# Altium schematic sheet FPGA_BANK.SchDoc
size 420 x 297 mm; SheetNumber: 29; SheetTotal: 34
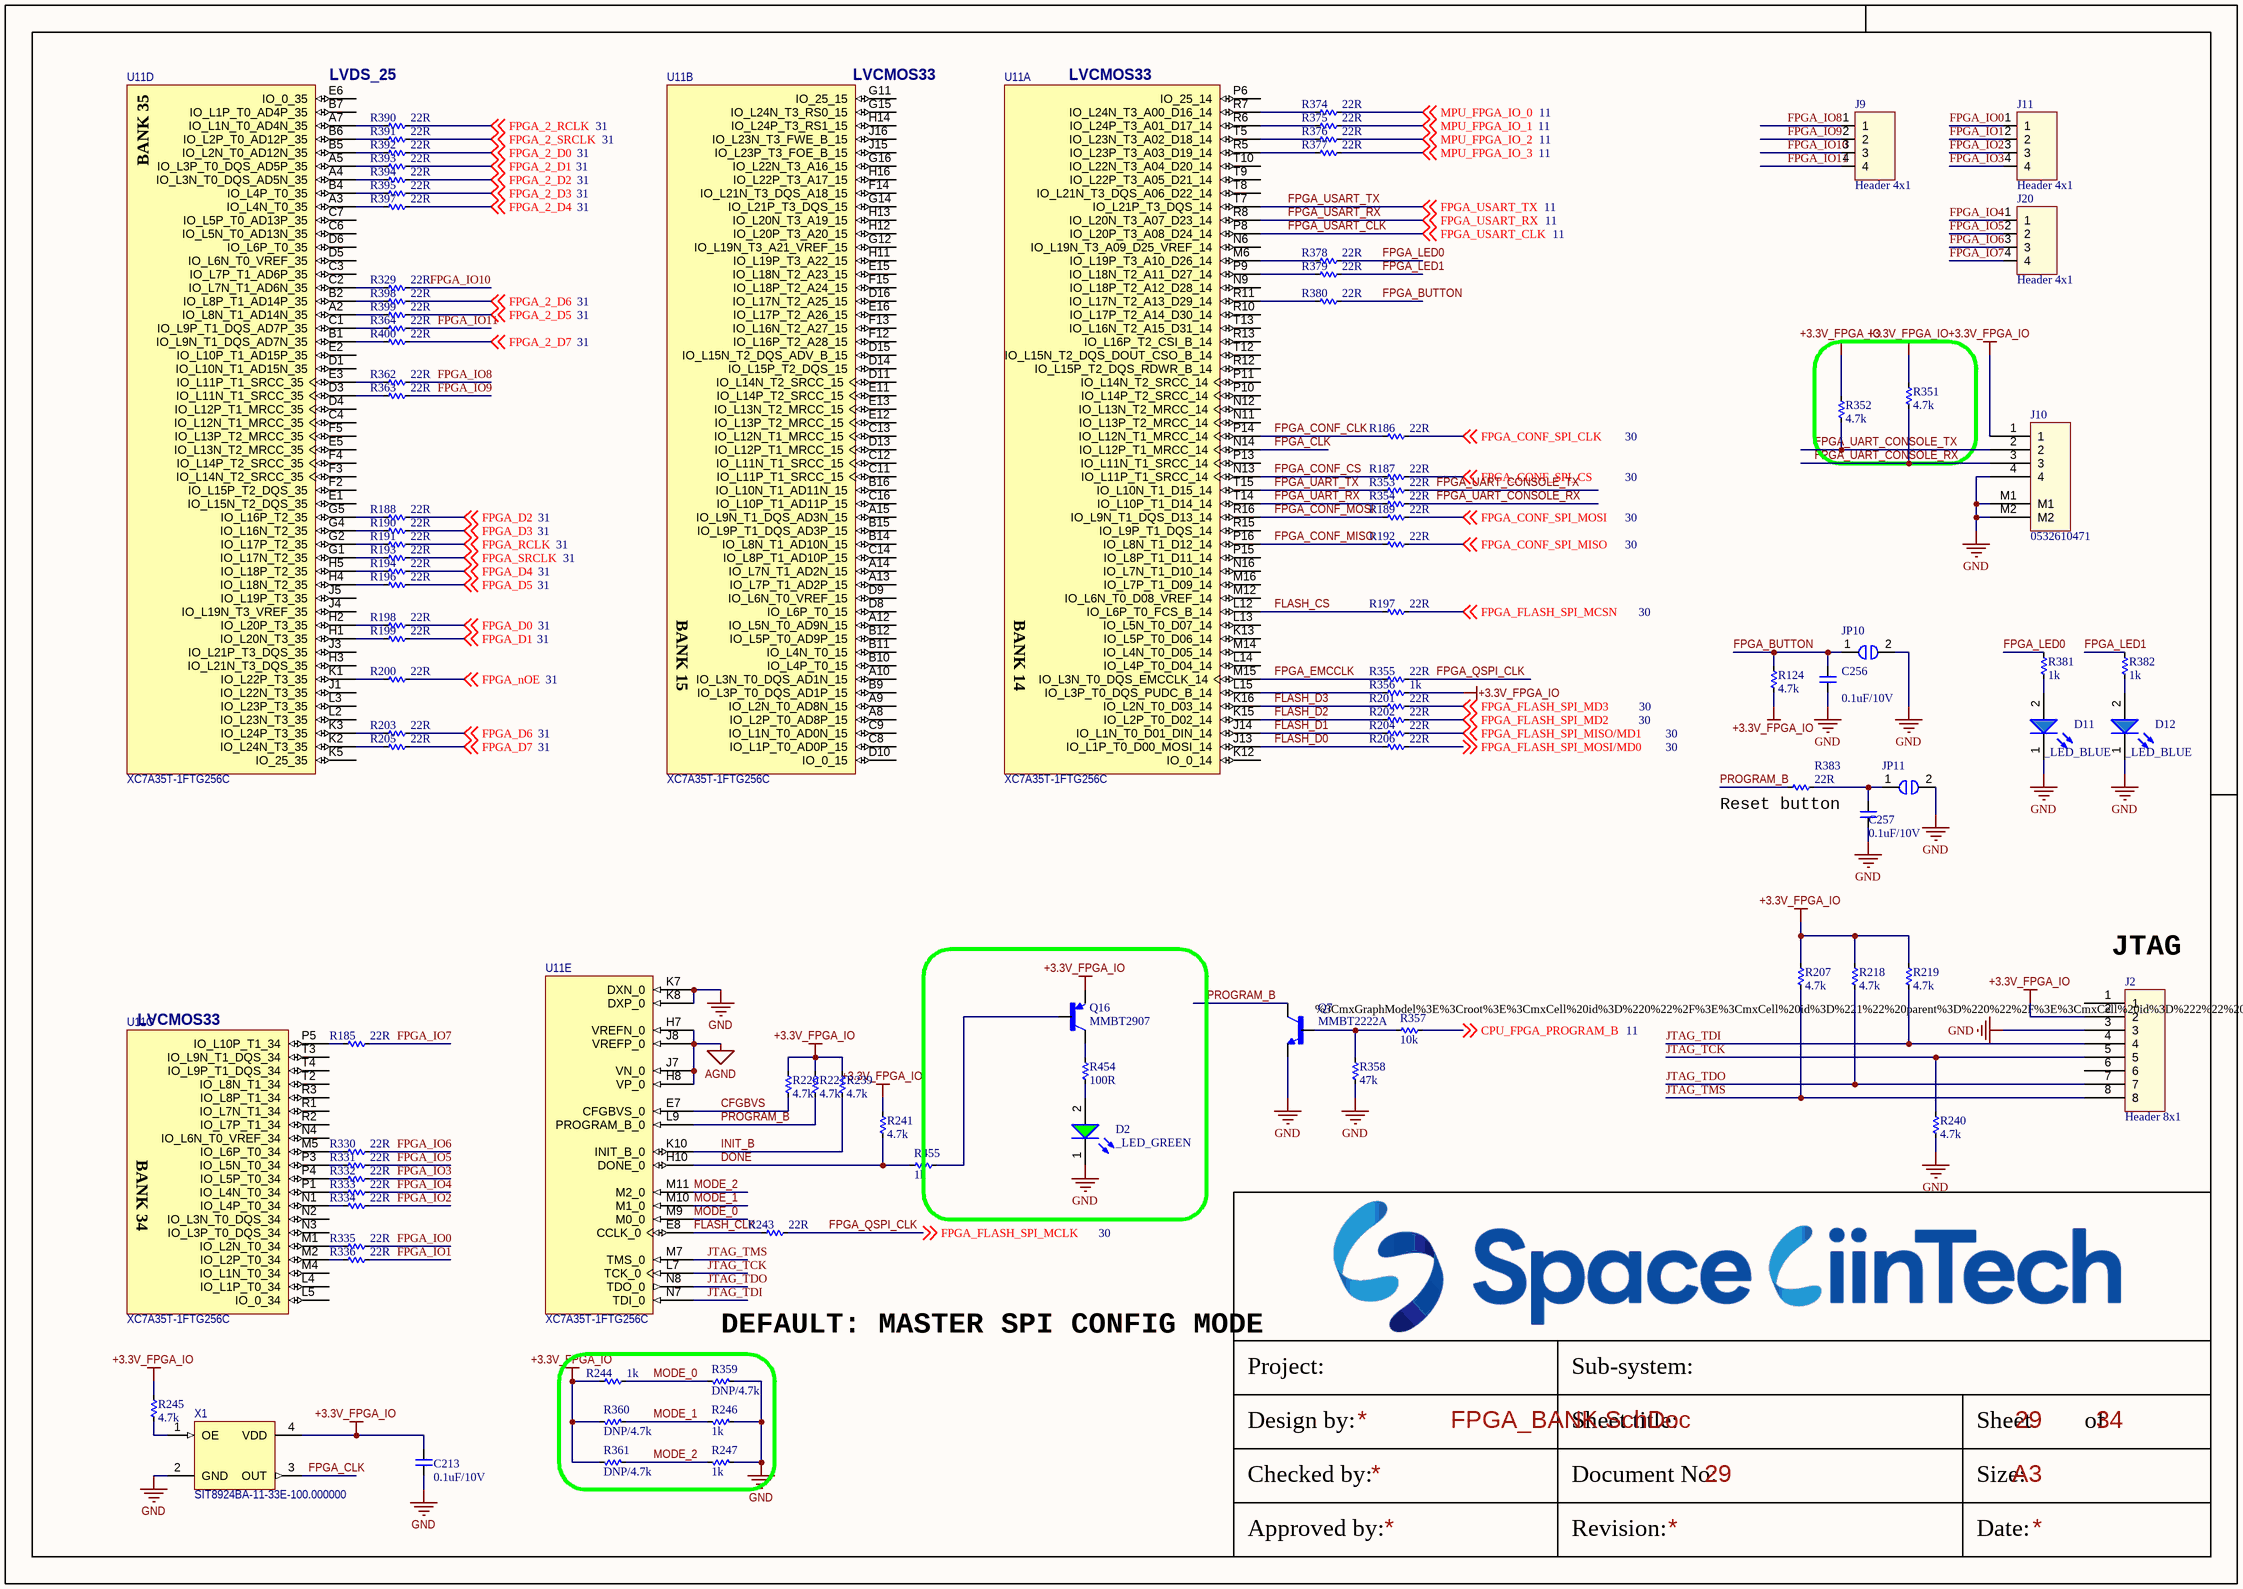
[diagram p0: FPGA_BANK.SchDoc]

## Parts
C213  0.1uF/10V  [CAP_C_1005X50_L]
C256  0.1uF/10V  [CAP_C_1005X50_L]
C257  0.1uF/10V  [CAP_C_1005X50_L]
D2  _LED_GREEN  [LED_0603]
D11  _LED_BLUE  [LED_0603]
D12  _LED_BLUE  [LED_0603]
J2  Header 8x1  [Header_254P_8x1]
J9  Header 4x1  [Header_254P_4x1]
J10  0532610471  [MOLEX_0532610471]
J11  Header 4x1  [Header_254P_4x1]
J20  Header 4x1  [Header_254P_4x1]
JP10  (no value)  [JUMPER_1608]
JP11  (no value)  [JUMPER_1608]
Q7  MMBT2222A  [SOT95P240X120-3N]
Q16  MMBT2907  [SOT95P240X120-3N]
R124  4.7k  [RES_C_1005x30_L]
R185  22R  [RES_C_1005x30_L]
R186  22R  [RES_C_1005x30_L]
R187  22R  [RES_C_1005x30_L]
R188  22R  [RES_C_1005x30_L]
R189  22R  [RES_C_1005x30_L]
R190  22R  [RES_C_1005x30_L]
R191  22R  [RES_C_1005x30_L]
R192  22R  [RES_C_1005x30_L]
R193  22R  [RES_C_1005x30_L]
R194  22R  [RES_C_1005x30_L]
R196  22R  [RES_C_1005x30_L]
R197  22R  [RES_C_1005x30_L]
R198  22R  [RES_C_1005x30_L]
R199  22R  [RES_C_1005x30_L]
R200  22R  [RES_C_1005x30_L]
R201  22R  [RES_C_1005x30_L]
R202  22R  [RES_C_1005x30_L]
R203  22R  [RES_C_1005x30_L]
R204  22R  [RES_C_1005x30_L]
R205  22R  [RES_C_1005x30_L]
R206  22R  [RES_C_1005x30_L]
R207  4.7k  [RES_C_1005x30_L]
R218  4.7k  [RES_C_1005x30_L]
R219  4.7k  [RES_C_1005x30_L]
R220  4.7k  [RES_C_1005x30_L]
R221  4.7k  [RES_C_1005x30_L]
R239  4.7k  [RES_C_1005x30_L]
R240  4.7k  [RES_C_1005x30_L]
R241  4.7k  [RES_C_1005x30_L]
R243  22R  [RES_C_1005x30_L]
R244  1k  [RES_C_1005x30_L]
R245  4.7k  [RES_C_1005x30_L]
R246  1k  [RES_C_1005x30_L]
R247  1k  [RES_C_1005x30_L]
R329  22R  [RES_C_1005x30_L]
R330  22R  [RES_C_1005x30_L]
R331  22R  [RES_C_1005x30_L]
R332  22R  [RES_C_1005x30_L]
R333  22R  [RES_C_1005x30_L]
R334  22R  [RES_C_1005x30_L]
R335  22R  [RES_C_1005x30_L]
R336  22R  [RES_C_1005x30_L]
R351  4.7k  [RES_C_1005x30_L]
R352  4.7k  [RES_C_1005x30_L]
R353  22R  [RES_C_1005x30_L]
R354  22R  [RES_C_1005x30_L]
R355  22R  [RES_C_1005x30_L]
R356  1k  [RES_C_1005x30_L]
R357  10k  [RES_C_1005x30_L]
R358  47k  [RES_C_1005x30_L]
R359  DNP/4.7k  [RES_C_1005x30_L]
R360  DNP/4.7k  [RES_C_1005x30_L]
R361  DNP/4.7k  [RES_C_1005x30_L]
R362  22R  [RES_C_1005x30_L]
R363  22R  [RES_C_1005x30_L]
R364  22R  [RES_C_1005x30_L]
R374  22R  [RES_C_1005x30_L]
R375  22R  [RES_C_1005x30_L]
R376  22R  [RES_C_1005x30_L]
R377  22R  [RES_C_1005x30_L]
R378  22R  [RES_C_1005x30_L]
R379  22R  [RES_C_1005x30_L]
R380  22R  [RES_C_1005x30_L]
R381  1k  [RES_C_1005x30_L]
R382  1k  [RES_C_1005x30_L]
R383  22R  [RES_C_1005x30_L]
R390  22R  [RES_C_1005x30_L]
R391  22R  [RES_C_1005x30_L]
R392  22R  [RES_C_1005x30_L]
R393  22R  [RES_C_1005x30_L]
R394  22R  [RES_C_1005x30_L]
R395  22R  [RES_C_1005x30_L]
R397  22R  [RES_C_1005x30_L]
R398  22R  [RES_C_1005x30_L]
R399  22R  [RES_C_1005x30_L]
R400  22R  [RES_C_1005x30_L]
R454  100R  [RES_C_1005x30_L]
R455  1k  [RES_C_1005x30_L]
U11  XC7A35T-1FTG256C  [FTG256]  (parts A,B,C,D,E of 8)
X1  SIT8924BA-11-33E-100.000000  [CRYSTAL_ABM8G]

## Blocks framed on the sheet
DEFAULT: MASTER SPI CONFIG MODE: R244 R246 R247 R359-R361

## Nets
+3.3V_FPGA_IO: C213.2 J2.2 J10.1 Q16.3(C) R124.1 R207.2 R218.2 R219.2 R220.2 R221.2 R239.2 R241.2 R244.1 R245.2 R351.1 R352.1 R356.2 R360.2 R361.2 X1.4(VDD)
AGND: U11.H7(VREFN_0) U11.H8(VP_0) U11.J7(VN_0) U11.J8(VREFP_0)
GND: C213.1 C256.1 C257.1 D2.1(K) D11.1(K) D12.1(K) J2.3 J10.4 J10.M1 J10.M2 JP10.2 JP11.2 Q7.2(E) R240.1 R246.1 R247.1 R358.1 R359.1 U11.K7(DXN_0) U11.K8(DXP_0) X1.2(GND)
CFGBVS: R220.1 U11.E7(CFGBVS_0)
CPU_FPGA_PROGRAM_B: R357.1 ; off-sheet CPU_FPGA_PROGRAM_B
DONE: R241.1 R455.2 U11.H10(DONE_0)
FLASH_CLK: R243.1 U11.E8(CCLK_0)
FLASH_CS: R197.1 U11.L12(IO_L6P_T0_FCS_B_14)
FLASH_D0: R206.1 U11.J13(IO_L1P_T0_D00_MOSI_14)
FLASH_D1: R204.1 U11.J14(IO_L1N_T0_D01_DIN_14)
FLASH_D2: R202.1 U11.K15(IO_L2P_T0_D02_14)
FLASH_D3: R201.1 U11.K16(IO_L2N_T0_D03_14)
FPGA_2_D0: R392.2 ; off-sheet FPGA_2_D0
FPGA_2_D1: R393.2 ; off-sheet FPGA_2_D1
FPGA_2_D2: R394.2 ; off-sheet FPGA_2_D2
FPGA_2_D3: R395.2 ; off-sheet FPGA_2_D3
FPGA_2_D4: R397.2 ; off-sheet FPGA_2_D4
FPGA_2_D5: R399.2 ; off-sheet FPGA_2_D5
FPGA_2_D6: R398.2 ; off-sheet FPGA_2_D6
FPGA_2_D7: R400.2 ; off-sheet FPGA_2_D7
FPGA_2_RCLK: R390.2 ; off-sheet FPGA_2_RCLK
FPGA_2_SRCLK: R391.2 ; off-sheet FPGA_2_SRCLK
FPGA_BUTTON: C256.2 JP10.1 R124.2 R380.2
FPGA_CLK: U11.N14(IO_L12P_T1_MRCC_14) X1.3(OUT)
FPGA_CONF_CLK: R186.1 U11.P14(IO_L12N_T1_MRCC_14)
FPGA_CONF_CS: R187.1 U11.N13(IO_L11P_T1_SRCC_14)
FPGA_CONF_MISO: R192.1 U11.P16(IO_L8N_T1_D12_14)
FPGA_CONF_MOSI: R189.1 U11.R16(IO_L9N_T1_DQS_D13_14)
FPGA_CONF_SPI_CLK: R186.2 ; off-sheet FPGA_CONF_SPI_CLK
FPGA_CONF_SPI_CS: R187.2 ; off-sheet FPGA_CONF_SPI_CS
FPGA_CONF_SPI_MISO: R192.2 ; off-sheet FPGA_CONF_SPI_MISO
FPGA_CONF_SPI_MOSI: R189.2 ; off-sheet FPGA_CONF_SPI_MOSI
FPGA_D0: R198.2 ; off-sheet FPGA_D0
FPGA_D1: R199.2 ; off-sheet FPGA_D1
FPGA_D2: R188.2 ; off-sheet FPGA_D2
FPGA_D3: R190.2 ; off-sheet FPGA_D3
FPGA_D4: R194.2 ; off-sheet FPGA_D4
FPGA_D5: R196.2 ; off-sheet FPGA_D5
FPGA_D6: R203.2 ; off-sheet FPGA_D6
FPGA_D7: R205.2 ; off-sheet FPGA_D7
FPGA_EMCCLK: R355.1 U11.M15(IO_L3N_T0_DQS_EMCCLK_14)
FPGA_FLASH_SPI_MCSN: R197.2 ; off-sheet FPGA_FLASH_SPI_MCSN
FPGA_FLASH_SPI_MD2: R202.2 ; off-sheet FPGA_FLASH_SPI_MD2
FPGA_FLASH_SPI_MD3: R201.2 ; off-sheet FPGA_FLASH_SPI_MD3
FPGA_FLASH_SPI_MISO/MD1: R204.2 ; off-sheet FPGA_FLASH_SPI_MISO/MD1
FPGA_FLASH_SPI_MOSI/MD0: R206.2 ; off-sheet FPGA_FLASH_SPI_MOSI/MD0
FPGA_IO0: J11.1 R335.2
FPGA_IO1: J11.2 R336.2
FPGA_IO2: J11.3 R334.2
FPGA_IO3: J11.4 R332.2
FPGA_IO4: J20.1 R333.2
FPGA_IO5: J20.2 R331.2
FPGA_IO6: J20.3 R330.2
FPGA_IO7: J20.4 R185.2
FPGA_IO8: J9.1 R362.2
FPGA_IO9: J9.2 R363.2
FPGA_IO10: J9.3 R329.2
FPGA_IO11: J9.4 R364.2
FPGA_LED0: R378.2 R381.2
FPGA_LED1: R379.2 R382.2
FPGA_nOE: R200.2 ; off-sheet FPGA_nOE
FPGA_QSPI_CLK: R243.2 R355.2 ; off-sheet FPGA_FLASH_SPI_MCLK  [also labelled FPGA_FLASH_SPI_MCLK]
FPGA_RCLK: R191.2 ; off-sheet FPGA_RCLK
FPGA_SRCLK: R193.2 ; off-sheet FPGA_SRCLK
FPGA_UART_CONSOLE_RX: J10.3 R351.2 R354.2
FPGA_UART_CONSOLE_TX: J10.2 R352.2 R353.2
FPGA_UART_RX: R354.1 U11.T14(IO_L10P_T1_D14_14)
FPGA_UART_TX: R353.1 U11.T15(IO_L10N_T1_D15_14)
FPGA_USART_CLK: U11.P8(IO_L20P_T3_A08_D24_14) ; off-sheet FPGA_USART_CLK
FPGA_USART_RX: U11.R8(IO_L20N_T3_A07_D23_14) ; off-sheet FPGA_USART_RX
FPGA_USART_TX: U11.T7(IO_L21P_T3_DQS_14) ; off-sheet FPGA_USART_TX
INIT_B: R239.1 U11.K10(INIT_B_0)
JTAG_TCK: J2.5 R240.2 U11.L7(TCK_0)
JTAG_TDI: J2.4 R219.1 U11.N7(TDI_0)
JTAG_TDO: J2.7 R218.1 U11.N8(TDO_0)
JTAG_TMS: J2.8 R207.1 U11.M7(TMS_0)
MODE_0: R244.2 R359.2 U11.M9(M0_0)
MODE_1: R246.2 R360.1 U11.M10(M1_0)
MODE_2: R247.2 R361.1 U11.M11(M2_0)
MPU_FPGA_IO_0: R374.2 ; off-sheet MPU_FPGA_IO_0
MPU_FPGA_IO_1: R375.2 ; off-sheet MPU_FPGA_IO_1
MPU_FPGA_IO_2: R376.2 ; off-sheet MPU_FPGA_IO_2
MPU_FPGA_IO_3: R377.2 ; off-sheet MPU_FPGA_IO_3
PROGRAM_B: Q7.3(C) R221.1 R383.1 U11.L9(PROGRAM_B_0)
NetC257_2: C257.2 JP11.1 R383.2
NetD2_2: D2.2(A) R454.1
NetD11_2: D11.2(A) R381.1
NetD12_2: D12.2(A) R382.1
NetQ7_1: Q7.1(B) R357.2 R358.2
NetQ16_1: Q16.1(B) R455.1
NetQ16_2: Q16.2(E) R454.2
NetR185_1: R185.1 U11.P5(IO_L10P_T1_34)
NetR188_1: R188.1 U11.G5(IO_L16P_T2_35)
NetR190_1: R190.1 U11.G4(IO_L16N_T2_35)
NetR191_1: R191.1 U11.G2(IO_L17P_T2_35)
NetR193_1: R193.1 U11.G1(IO_L17N_T2_35)
NetR194_1: R194.1 U11.H5(IO_L18P_T2_35)
NetR196_1: R196.1 U11.H4(IO_L18N_T2_35)
NetR198_1: R198.1 U11.H2(IO_L20P_T3_35)
NetR199_1: R199.1 U11.H1(IO_L20N_T3_35)
NetR200_1: R200.1 U11.K1(IO_L22P_T3_35)
NetR203_1: R203.1 U11.K3(IO_L24P_T3_35)
NetR205_1: R205.1 U11.K2(IO_L24N_T3_35)
NetR245_1: R245.1 X1.1(OE)
NetR329_1: R329.1 U11.C2(IO_L7N_T1_AD6N_35)
NetR330_1: R330.1 U11.M5(IO_L6P_T0_34)
NetR331_1: R331.1 U11.P3(IO_L5N_T0_34)
NetR332_1: R332.1 U11.P4(IO_L5P_T0_34)
NetR333_1: R333.1 U11.P1(IO_L4N_T0_34)
NetR334_1: R334.1 U11.N1(IO_L4P_T0_34)
NetR335_1: R335.1 U11.M1(IO_L2N_T0_34)
NetR336_1: R336.1 U11.M2(IO_L2P_T0_34)
NetR356_1: R356.1 U11.L15(IO_L3P_T0_DQS_PUDC_B_14)
NetR362_1: R362.1 U11.E3(IO_L11P_T1_SRCC_35)
NetR363_1: R363.1 U11.D3(IO_L11N_T1_SRCC_35)
NetR364_1: R364.1 U11.C1(IO_L9P_T1_DQS_AD7P_35)
NetR374_1: R374.1 U11.R7(IO_L24N_T3_A00_D16_14)
NetR375_1: R375.1 U11.R6(IO_L24P_T3_A01_D17_14)
NetR376_1: R376.1 U11.T5(IO_L23N_T3_A02_D18_14)
NetR377_1: R377.1 U11.R5(IO_L23P_T3_A03_D19_14)
NetR378_1: R378.1 U11.M6(IO_L19P_T3_A10_D26_14)
NetR379_1: R379.1 U11.P9(IO_L18N_T2_A11_D27_14)
NetR380_1: R380.1 U11.R11(IO_L17N_T2_A13_D29_14)
NetR390_1: R390.1 U11.A7(IO_L1N_T0_AD4N_35)
NetR391_1: R391.1 U11.B6(IO_L2P_T0_AD12P_35)
NetR392_1: R392.1 U11.B5(IO_L2N_T0_AD12N_35)
NetR393_1: R393.1 U11.A5(IO_L3P_T0_DQS_AD5P_35)
NetR394_1: R394.1 U11.A4(IO_L3N_T0_DQS_AD5N_35)
NetR395_1: R395.1 U11.B4(IO_L4P_T0_35)
NetR397_1: R397.1 U11.A3(IO_L4N_T0_35)
NetR398_1: R398.1 U11.B2(IO_L8P_T1_AD14P_35)
NetR399_1: R399.1 U11.A2(IO_L8N_T1_AD14N_35)
NetR400_1: R400.1 U11.B1(IO_L9N_T1_DQS_AD7N_35)

Not connected (* = marked no-connect by the designer): J2 1 6; U11 A8(IO_L2P_T0_AD8P_15) A9(IO_L2N_T0_AD8N_15) A10(IO_L3N_T0_DQS_AD1N_15) A12(IO_L5N_T0_AD9N_15) A13(IO_L7P_T1_AD2P_15) A14(IO_L7N_T1_AD2N_15) A15(IO_L9N_T1_DQS_AD3N_15) B7(IO_L1P_T0_AD4P_35) B9(IO_L3P_T0_DQS_AD1P_15) B10(IO_L4P_T0_15) B11(IO_L4N_T0_15) B12(IO_L5P_T0_AD9P_15) B14(IO_L8N_T1_AD10N_15) B15(IO_L9P_T1_DQS_AD3P_15) B16(IO_L10N_T1_AD11N_15) C3(IO_L7P_T1_AD6P_35) C4(IO_L12N_T1_MRCC_35) C6(IO_L5N_T0_AD13N_35) C7(IO_L5P_T0_AD13P_35) C8(IO_L1P_T0_AD0P_15) C9(IO_L1N_T0_AD0N_15) C11(IO_L11P_T1_SRCC_15) C12(IO_L11N_T1_SRCC_15) C13(IO_L12N_T1_MRCC_15) C14(IO_L8P_T1_AD10P_15) C16(IO_L10P_T1_AD11P_15) D1(IO_L10N_T1_AD15N_35) D4(IO_L12P_T1_MRCC_35) D5(IO_L6N_T0_VREF_35) D6(IO_L6P_T0_35) D8(IO_L6P_T0_15) D9(IO_L6N_T0_VREF_15) D10(IO_0_15) D11(IO_L14N_T2_SRCC_15) D13(IO_L12P_T1_MRCC_15) D14(IO_L15P_T2_DQS_15) D15(IO_L15N_T2_DQS_ADV_B_15) D16(IO_L17N_T2_A25_15) E1(IO_L15N_T2_DQS_35) E2(IO_L10P_T1_AD15P_35) E5(IO_L13N_T2_MRCC_35) E6(IO_0_35) E11(IO_L14P_T2_SRCC_15) E12(IO_L13P_T2_MRCC_15) E13(IO_L13N_T2_MRCC_15) E15(IO_L18N_T2_A23_15) E16(IO_L17P_T2_A26_15) F2(IO_L15P_T2_DQS_35) F3(IO_L14N_T2_SRCC_35) F4(IO_L14P_T2_SRCC_35) F5(IO_L13P_T2_MRCC_35) F12(IO_L16P_T2_A28_15) F13(IO_L16N_T2_A27_15) F14(IO_L21N_T3_DQS_A18_15) F15(IO_L18P_T2_A24_15) G11(IO_25_15) G12(IO_L19N_T3_A21_VREF_15) G14(IO_L21P_T3_DQS_15) G15(IO_L24N_T3_RS0_15) G16(IO_L22N_T3_A16_15) H3(IO_L21N_T3_DQS_35) H11(IO_L19P_T3_A22_15) H12(IO_L20P_T3_A20_15) H13(IO_L20N_T3_A19_15) H14(IO_L24P_T3_RS1_15) H16(IO_L22P_T3_A17_15) J1(IO_L22N_T3_35) J3(IO_L21P_T3_DQS_35) J4(IO_L19N_T3_VREF_35) J5(IO_L19P_T3_35) J15(IO_L23P_T3_FOE_B_15) J16(IO_L23N_T3_FWE_B_15) K5(IO_25_35) K12(IO_0_14) K13(IO_L5P_T0_D06_14) L2(IO_L23N_T3_35) L3(IO_L23P_T3_35) L4(IO_L1P_T0_34) L5(IO_0_34) L13(IO_L5N_T0_D07_14) L14(IO_L4P_T0_D04_14) M4(IO_L1N_T0_34) M12(IO_L6N_T0_D08_VREF_14) M14(IO_L4N_T0_D05_14) M16(IO_L7P_T1_D09_14) N2(IO_L3N_T0_DQS_34) N3(IO_L3P_T0_DQS_34) N4(IO_L6N_T0_VREF_34) N6(IO_L19N_T3_A09_D25_VREF_14) N9(IO_L18P_T2_A12_D28_14) N11(IO_L13P_T2_MRCC_14) N12(IO_L13N_T2_MRCC_14) N16(IO_L7N_T1_D10_14) P6(IO_25_14) P10(IO_L14P_T2_SRCC_14) P11(IO_L14N_T2_SRCC_14) P13(IO_L11N_T1_SRCC_14) P15(IO_L8P_T1_D11_14) R1(IO_L7N_T1_34) R2(IO_L7P_T1_34) R3(IO_L8P_T1_34) R10(IO_L17P_T2_A14_D30_14) R12(IO_L15P_T2_DQS_RDWR_B_14) R13(IO_L16P_T2_CSI_B_14) R15(IO_L9P_T1_DQS_14) T2(IO_L8N_T1_34) T3(IO_L9N_T1_DQS_34) T4(IO_L9P_T1_DQS_34) T8(IO_L21N_T3_DQS_A06_D22_14) T9(IO_L22P_T3_A05_D21_14) T10(IO_L22N_T3_A04_D20_14) T12(IO_L15N_T2_DQS_DOUT_CSO_B_14) T13(IO_L16N_T2_A15_D31_14)

## Notes on the sheet
- (near U11) LVDS_25
- LVCMOS33
- (near U11) LVCMOS33
- (near R383) Reset button
- (near J2) JTAG
- (near Q7) %3CmxGraphModel%3E%3Croot%3E%3CmxCell%20id%3D%220%22%2F%3E%3CmxCell%20id%3D%221%22%20parent%3D%220%22%2F%3E%3CmxCell%20id%3D%222%22%20parent%3D%221%22%20style%3D%22shape%3Dimage%3BverticalLabelPosition%3Dbottom%3BlabelBackgroundColor%3Ddefault%3BverticalAlign%3Dtop%3Baspect%3Dfixed%3BimageAspect%3D0%3Bimage%3Ddata%3Aimage%2Fpng%2CiVBORw0KGgoAAAANSUhEUgAAAUsAAAEoCAYAAADR19NqAAAAAXNSR0IArs4c6QAAAARnQU1BAACxjwv8YQUAAAAJcEhZcwAADsMAAA7DAcdvqGQAAChzSURBVHhe7d1RaBtX%2Fi%2Fwr%2B6F9KJI7V3WpVhurXXonwQHbruVvGQLW8mJl60vtrekenBgIz20D107m33wg82yNYsLu9KDX4zl7EOyYBU2eVBLKxVSWDeWs2w3IIn%2F5sGiZkO8ShuJUi9tI8WQwL1zH%2F4%2Bc2eORvLYkVPp6PsBQTJzNNZoRl%2FNmRmdn0PTNA1ERNTQf5MnEBFRLYYlEZENDEsiIhsYlkRENjAsiYhsYFgSEdnAsCQisoFhSURkA8OSiMgGhiURkQ0MSyIiGxiWREQ2MCyJiGxgWBIR2cCwJCKygWFJRGQDw5KIyAaGJRGRDQxLIiIbGJZERDa0TFjGYjEEg0FUq1V5FmKxGBwOh%2F44fPgw8vm83Ex55XIZkUjE8j1qllgshkgkAgBIp9NwOByIxWJyM10%2Bn8fhw4cbtpGl02l4vV6Uy2V5VlPJ%2B43D4aj5u9VqFcFgUJ9fbx8U0um05f5XLpfh9Xr15Yj3sN588ZDfN%2FGei0c6nTbN341Yn3rPy%2BfzePHFFy3f%2B0gkUvd9kqXT6Zr3qlwu48UXX6x5b1TRMmFpRWz4paUllEolaJoGTdNw5coV%2BP3%2Bmh1NdTMzMygWi%2FLkpsnn87h8%2BTKi0ag%2Bzel0Ih6PW77X1WoVU1NT2N7elme1hEKhgHA4rO83mqahWCyiu7sb2Hn9IyMj8Hq90DQNlUoFADA5OSkt6b%2BUy2WcO3dOnoxyuYwTJ05gYmICmqahVCohk8mY3jOx%2F%2BZyOdPrmZ6e1tuk02mMj4%2FrbVKpFMbHx%2FcUPpOTk1hbW5MnAzuv8%2FTp0%2Fj666%2FlWYhEIshkMvrrXFxcxIkTJywDM5%2FPY3x8XJ6M7u5uvPPOO5iammr4hdOuWjosxU67vr6u7%2BAAMDo6ilwuh7m5ubrfoLQ3IvjOnDljeq8B4KWXXsLVq1drPgCrq6sAgN7eXtP0VlCtVlEsFtHf3y%2FP0q2uriKbzeL8%2BfMAAJfLhfn5eayurloG1MzMDO7cuSNPRiKRAACEw2FgJzQWFxextLSkh02pVILD4YDH4zE9V6hWq5ifn0coFILP5wN29vNQKISFhQW5eQ1x5CpeiyydTsPj8Vi%2B%2Fnw%2Bj2QyicXFRX3bj46OIhgMYmZmxtQ2FovB7%2FfX%2FYIcHBwEDPuGSlo2LMUGnJqagsvlkmfD5%2FMhFAphfn6%2B5kNsJLqJ9bpZu80Xpwd%2B%2B9vf6m3kbpidNqLdbl0suU0sFtOPsBOJBNbW1vDMM8%2Foy5a7d3L3KRaL4bXXXtO7mnL3UNjY2MDt27cxNDQkz8Krr76K27dvY2NjwzQ9mUxaHmFA6tLVW1cjeTsYX6d4T4zL2O0UQaVSwTfffGO5PkKhUMDAwACOHj2qTzt69CiOHDmClZUVU9t0Oo1MJoMLFy6YpmNnOcFg0PQl4%2Ff7AQC5XK5uG6NKpYLNzU2EQiHT9FAohEwmY3mEJ4gj276%2BPqyursLpdJrmp9NpjI2NIRqNmnoNQqlUQldXl%2F6ahf7%2BfhSLRf3zEIvFMDMzg1QqpX8xyFwuF4aHh3f9XLajlg3LehvQKBQKYXNzU%2B8%2BydLpNPx%2BP65cuaJ3e7xeL0ZGRlCtVvX5s7Ozpm6YmC%2Bsra3h888%2F19sMDAzUdDV2axOLxTA3N6d3sXK5HMbHx00f9kgkYjrlUCqVsLS0hHg8jkwmg3A4jEAggC%2B%2F%2FBI%2Bnw%2F5fB7PP%2F88gsGgvn7BYLCm%2B%2FThhx9ieHgYmqZheXlZn260srKCI0eOmIJDOHbsGI4cOYJSqaRPK5fLKBaL%2BNGPfmRqK4Ld2KVLpVIYGxurG5j5fB6vvPKKaTsUi0X9i2t6ehrhcFj%2FAIrucDgcNnVjjXK5HG7evAm%2F31%2F3i6RQKMDr9Vp%2BGRcKBf3f4u9NTEygp6fH1G63I9hCoYBqtYqrV68ikUjUfBEK4r2yOvLc2toyvfey7u5uFItFZDIZuN1ueTZGR0druvx2GT9f09PT0DQNo6OjcjOToaEhyy%2FXdteyYWncWRtptCMlk0mEw2HTxl1eXkYmkwEAzM%2FPmz5wohuWzWZN3Yje3l79G9nlcmFqagrZbNa0MzRqUy6XsbS0hNnZWb2L5fP5MDs7q3fVyuUyMpmMqSskPgT1dvKFhQUMDAwgHo%2Fr08RrMHbHent76x4JYOcDf%2FXq1brB4Xa7MTw8jGQyqU%2FL5XLwer01R0qia%2Fv%2B%2B%2B%2BbunTGsJOJ9RCnXay2QzQaxebmJuLxuN41tDpKEsT%2Bk0qlGn6R2JFIJNDX11f3XOZuxFFjIBBApVLRvyzn5ubqHhk%2FTh6PB1tbW%2FpRsGD3MyjzeDxwOBx1P5ftqmXD8lGJ8Kn3jS92YHn%2B0aNHMTAwYAqGvr4%2By29so0Ztcrkctra2arqEQ0ND%2BhGkaGN1ZGFFHNHIAdfd3Y1gMGg6x9jotaHBe2HU39%2BvdwerhvNrskKhgK6urpr1CIVCNV8wMGyn4eFh03qI7SA%2BsN3d3ZiYmMDMzAwSiYTpS8WK1VGQ1RfJbvL5POLxOObn5y2%2FSOwwHvmJZchflt8l8V6fO3dOfy3pdHpP75OR2%2B1GX1%2FfvsO2VbVsWDb64BpZfTCNdlvObvObZXt729QldDgc8Pv9%2BPe%2F%2F6232W1drDyu1288B7exsYFvvvmm7imS3cLZyszMjOm9cbvdNVd1w%2BEwent7EQgE9AsJe7HXD3F156LX5OSk3iNopv7%2B%2FoY9o8fF5XLho48%2BQl9fn35UmEwmGx6522H3fW4XLRuW9boGRslkctcP5m4brN78ZoeQ0%2BmsuW1E0zTcv39f%2FyDu54NT7%2FXLR5yPShyxJpNJrKys4IUXXqh7ZFfvPHKjL4NoNFrz3sjn2cTV6LW1NdOph%2F2SL2DI8zY2NpDNZk1BPjY2pn%2FxxWIxuFwueL3eutvB7n7UqOsq3jf54p98MfJRuFwuZDIZ%2FX1fXl5GoVDY9fPViN11bxctG5a7Xe3e7Wr5bkcR9eaLD0gzN7QICPmDkDbcnF2vTT3iQyp%2F2Hc7%2FWCl3nshC4VCSCaTiMfjll1wNDhaqvfFVu9vl3eu8ouLQqJbmEqlEI1GMTc3V3O3gVEkEqkJE%2FmKc39%2Ff82pAeNdAT6fD%2Ffv3zeFdyqV0r%2F4RJAbT1EI4kve7%2FfrV%2FrlC1wFw9V48T4YT%2F9g530TV9HFqQXxMHbrH4XV66t3esQOO6d12pLWIqLRqBYIBLRKpaJPq1QqWiAQ0Hp7e7VSqaRPT6VSGgAtGo3q06yIdqlUSp8WjUb15cnLEX%2FP%2BDqsXlcqldKcTqeWy%2BX21Mb4%2F1KppPX29prWIRwOm9ZVvJ5wOKzPN%2F6dXC6nOZ1Ofb7VMqxemxWrdvI6iL9nXL68HlbbTN4OqVTKNF8sV34vxOuRt4v8fyvyMq2eI0%2BT328r8nuiGd4D8Tz5PdEstov8nlhNs%2FpbuxHrbVyukXH%2FF%2BT3QbN4vTJ5XzTK5XLac889t6fX3Q5aOiyN8wDoj73sQGLnEc%2BVdwB5vvxBsXpd8k5sp41oZ1wP44epXhvj6zG%2BVvFhEB9M0V5%2BHVavzYrVDi6vg1WYWAWDtvNhqre95LDULLaD%2FMGVlyHay9vLqNEyBbFOjdoYye%2BJIG8Hq9dlfE%2BM29BIBGajNo2Ida73PKuw1PbxPjQKS7v7XLtxaJqmyUeb1HmqOz%2F9Gx4ernurEtFuxH40NTW16%2F2Y7aZlz1nS4yXubbx8%2BfJ3fisLtS9xX%2Bx%2B7lZodTyyJJNYLIZCoVD3lz5E9ZTLZQwPD%2BPSpUsHcqvVd41hSURkA7vhREQ2MCyJiGxgWBIR2cCwJCKygWFJRGQDw5KIyAaGJRGRDQxLIiIbGJZERDYwLImIbGBYEhHZwLAkIrKBYUlEZENLjDrkcDjkSUSkgBaIl6bhkSURkQ0MSyIiGxiWREQ2tH1YrqysmGopGx%2F37t3D2bNn9bbr6%2BvQNA3r6%2BumZZA9Z8%2Bexb1792reZ%2FG4ePGi%2FJTvnNg%2FvvjiC5w8eVKevav19XV9vYzr34rrSger7cOyEbfbjXg8bgpMOjhvvPEGVlZW5Mlt6eTJk%2Fjiiy%2FQ398vz6IOpUxY3r17F6dOnYLD4YDD4cA777yDhw8fwu12IxAIAACOHz8Oh8OB48ePy0%2BnPbp06ZL%2BXjscDhQKBQDAT37yE8zNzcnNvzNDQ0NwOBx49tlnce3aNXn2nrz77rt48skn4XA48Oabb8qzSXHKhKUsk8ngq6%2B%2BAgD84Ac%2FACy64XNzc3jw4AEePHiAixcvmrqYqhwhPS6%2F%2BtWvcPfuXRw6dAgvv%2FyyPl3uult1h%2BVTKVZt5OXUO8XyxRdf6O3W19druuHG5aRSKcttfvbsWXzwwQfo6ekBdo6Y7927hz%2F%2B8Y91u%2BHi78vLkucbX5PVelDrUjYsg8Egnn76aQDAv%2F71L3m2yaFDh%2FDGG2%2FA7Xbr006dOlXzgaD6rl27hs8%2B%2BwwAcOzYMZw8eRJzc3O4ePGi6X3t6enBBx98oAfEysoKTp06pc8XbRKJhB6YVsupd4qlp6dHb7db%2FfPR0dGabS6H3G7qdddPnTpleW68v7%2FftL5utxt%2F%2BMMfar4cqPUoE5Y9PT345JNP9G%2Fst99%2BG4cOHcLdu3fx5z%2F%2FWW5eo1AowOFwIBwOo1KpAAB%2B%2FOMfy82oAflL6fXXX8ehQ4fwySefmLrrbrcbkUgEANDd3Q0Aehtx%2BuTpp59GMBg0LUecajl16hTu3r1rWo7w8OFDvPPOO3A4HBgaGjLNkxlP3YjTCMeOHcPdu3fx2muv4e7du8DOKYcnn3wSf%2Fvb36QlAL%2F5zW%2FQ09Nj%2BrtiHfr7%2B2u%2BcI3tPvnkEwAwrSu1LmXC0kqhULB1rurhw4d47733gJ3zUp9%2F%2FrnchPbopz%2F9KZ577jlg5yhLfImJIzARkuLoT7R5%2BeWX8cQTT%2BCJJ57A7OwsTp48iaeeegoA8PHHH%2BPatWu4du0ann32WctAvHXrFmZnZ03T6hHLA4D33nuvJqR3c%2FLkSRw7dgwA8Ne%2F%2FlX%2Fu7Ozs7h16xZg8YVrfH2ffvopHj58aJpPrUuZsJQv8Dh4IeexE%2BeG7Xjqqadw8uRJ%2FP73v9eP4GAITXEur6enB08%2B%2BaTpuc3w8OFDlEol%2Ff%2F%2F%2FOc%2F8eDBA1ObvZCPqnc7BUDtR5mwpO%2BeOFr87LPP9G4tLK6cOwxXp41HicbusOhi3717F%2Ffu3dOX1SyHDh2Cx%2BPR%2F%2F8f%2F%2FEfeOKJJ0xt9kL%2BohDvBamDYUlNsbKygv7%2Bfjx8%2BBCffvqp6XTGq6%2B%2BipMnT%2BoXQ8TVYvn%2F2Lm9SwRmd3c3rl27hm%2B%2F%2Fda0HFjc2bAfxuWJ86JfffUVMpmMqZ0chILxopbxlqm5uTk8%2F%2FzzAIC%2F%2F%2F3vpudQ%2B2JY0r688cYbpltlxBVe47k7cR5QXHz75JNP0NPTg0qlguXlZVy7dg0ff%2FwxUOe8pggaeTmijfFc837Iy4N0HlM4deoUHjx4gNdff900HQCWl5dRqVRw6NAhvP3226aLi4VCgfdjKoRhSU0hrvIaL7jMzs4iFouZLmJUKhVMTk7i3XffBQC8%2BeabuHTpkj4fhmWJoJmdncWbb76p36Ug2sRiMdsXc6yk02nTMi9duqT%2FzWvXruFPf%2FrTrhdgxI3qxtMO2Lm6z3PmitFaAAA%2B%2BHgsj7Nnz2r37t3TNE3TLl68WDOfj%2BY%2BVMIjSyIiGxiWREQ2sKwEER2YFoiXpmmZsGyBl9F0qq4XkR2q7f%2FshhMR2cCwJCKyoePCMhKJIBaLyZOphcVisZqfS8rbsFqtIhgMwuv1Wv4uO51O4%2FDhw8jn8%2Fr%2F5WWKRzqdlp9O1FlhGYvFkEgk5MnUosrlMrxeL65evYpKpaL%2FwieXy2Fubg7BYBDVatX0nDt37mBmZsY0rR6n04lcLmf6JVIul8P4%2BHhNGBN1RFiKow67HyL67lWrVZw5cwbBYBCZTAYul0uf5%2FP5cP36dWSzWayurpqeBwCJRGLfR4c%2Bnw9XrlzB3NycfhRKhE4Iy2q1ipGREWxubiKfz6O3t1duQi1oY2MDt2%2Ffxvnz5%2BVZAICjR48iFAqZRjoHgJ%2F%2F%2FOcIBAKYn5%2BvOeq0a3BwEAMDA1hYWJBnUQdTPixdLhcymQyKxSKHzWojKysrOHLkCI4ePSrPAna26%2FLycs1AvU899RTm5%2BeRzWYRj8dN8%2BxyuVzwer0oFov7DlxSj%2FJhSe1JHphiL3w%2BH0Kh0CN1peWaOkQMS2ob4oKP8cq11UUeAIhGo%2Bjq6sLU1JTlfKK9YlhSS7I6suvu7kaxWNSvXIfDYbmJrru7G4uLi1hbW9tXd%2FxRjmxJTQxLakn9%2Ff3IZrPY2NiQZ9k2OjqKcDiMpaUlU52f3VSrVRSLRQwPD5uuwlNnY1hSS2rWFeloNAoA%2BOUvfynPqmt1dRXZbLamciR1NoYltSSXy4XLly8jk8nU%2FCpHnLtMJBKYmppqePQnuuN25fN5jI%2BPY3Z2Fj6fT55NHYxhSS1LnKOcmJiAx%2BPRL%2Bp4PB4Eg0FomobR0VH5aTUGBwcRCATkydje3obf7zddMPL7%2Fbhy5Qqmp6fl5tThOETbAVJ1vYjsUG3%2F55ElEZENDEsiIhtaphtOROppgXhpmpYJyxZ4GU2n6noR2aHa%2Fs9uOBGRDQxLIiIbGJZERDZ0RFjK9VbqjVRD3x0xmr1xOxkfkUhEfoouEok03L5i2Y2W0ahNPp%2FH4cOHTTV8qPMoH5bpdBpjY2NIpVLQNA2VSgUAMDIywsBsQeFw2FQTR9upi5NMJmvq4ogQw85VV%2FHwer145plnmhJs5XIZp0%2BfRldXF27dusWfQHYw5cMymUwiHA7rP4tzuVz6SNpW9Vuo9fh8PszOzmJpaUn%2FjXi1WsXU1BRCoRCWl5dN7ePxOAYGBh55LMtyuYwTJ04AAG7cuMGR9juc8mG5vLxc82HyeDzo6uoyTaPW1t%2Ffj62tLZRKJcAwMpBVjR6Xy4Xf%2Fe53%2BOijjxoOstEIg5JkyoellVwuh62tLXg8HnkWtahCoYCuri59mxUKBQwMDNSt0RMMBvcdlKKyJBiUZNBxYVmtVjE%2FP9%2Fwg0atJZ%2FPY25uDhMTE3pwHdRI5t9%2B%2By1GRkawtraGYDDIoCRdx4Xl5OQkstks5ufn933kQQcnkUjUXAn3%2B%2F2YnZ19LMOmffjhh9jc3MSFCxeQSCRqLipR5%2BqosIxEIkgmk7h%2B%2FTqvarYo49XwUqmE3t5eBAIBTE5OmtpZ1ehpht7eXty4cQNvvfUWwuHwI1WIJLV0TFgyKNtPd3c33n%2F%2FfWSzWcuwbFSjJ51O7%2Bu%2BSGPXW1SIPH36tGmkdupMHRGWDMr2JW4bSiQSSKfT%2BvRGNXqadV5ahPXW1hZmZmbk2dRhlA%2FLWCzGoGxzk5OTCAQCOHfunH6EJ%2B6XTSaTNb%2B6aeZ5aWNY8%2FxlZ1M6LMvlMpaWlixrrTgcDu78bUIE49bWFs6cOaPfaO7z%2BfDll1%2BiWCyatmuxWMSXX35Z8%2BVodfHI4XCYjlitTE9PIxwOY2ZmhvtMB%2BN4lgdI1fUiskO1%2FV%2FpI0siomZhWBIR2dAy3XAiUk8LxEvTtExYtsDLaDpV14vIDtX2f3bDiYhsYFgSEdnQEWEpRtQW99XJNzHT42dVRsLq54lyyQjjQy4fYRSLxUxtvV5vzU8WI5FIw2WgQZtyuQyv1wuHjfs0SQ3Kh6UoCzA7O6sPzpDJZBiY36FyuYzjx4%2FD6%2FWaykFcuXIFfr%2B%2FJnwCgQAqlYqpbalUwubmZs1vxkWIXb161fSciYkJeDyemmXvhxjvcmtrC7lcTh%2BFn9SmfFgmEglgZzQb7Pzed3FxEZlMpuZIgx6PXC4H7AxUYTQ6OopwOIz5%2BfmaIzmZ2I7JZNJ0NDozM4O%2Bvr6aUdLFr3CMP5ncj2q1ipGREWSzWf6EtsMoH5bT09MoFoumQVwPauBYsqfR%2B7%2B8vIxMJmPrN91i1HRRaiKfzyOZTGJqasry%2Bb%2F%2B9a8faeRzBmVnUz4sZeL34sZRt%2BnxGhoa0st6PEq3WISkMTS7urrg9%2Fullv%2FlpZdeeqRtLgboYFB2po4JS3FBQXywRLecHj%2Bfz4fr16%2FD6XRibGzM1gUbWblcxrlz5xAKhfTganTE%2Bqh%2B8YtfIJFIPPKwb9S%2BOiYsXS4XMpkMNE3D4uIinn%2F%2B%2BZorr%2FT4%2BHw%2B3L9%2FH5qm6ecu19bW4Ha7a0b2EdONV7c9Hg%2BCwWBN5c6DsLa2hr%2F85S%2B4cOGC5UDE1Bk6JiyNGg0cS4%2Ff9PQ0NE1DpVJBIBAw1QeHdDVctOnt7a25QHRQpSacTieuX7%2BOt956y3IgYuoMHRmW1JpcLhempqZM9cFlLpcLly9fBgDT2JbYOXcpbuexIu633WvQGbveYiDi8fFx9kw6jPJhaXVTcaVSwebm5oEdiVB94txxo%2FtcjfXBrYjbhtbW1hCPx%2FXpPp8PoVCo7q1HCwsLDS8A2SHCuqurC1NTU5Z%2FhxSltYCDfBm5XE5zOp1aNBrVp4XDYa23t1crlUqmts12kOvVzlKplAbAtE00TdMqlYoWCARqtlUgENAqlYqprZjndDq1XC6nTyuVSlpvb2%2FNc6LRqAZAS6VS%2BrRGyxbqtRHrEA6HTdPp%2F1Nt%2F2%2BJtTnoN1UEJgANgOXOfxAOer3amQg1sU0A1ASf1iCsNMMyrL74wuGwadl22hgfIrAb%2FX0RwAxMa6rt%2Fxyi7QCpul5Edqi2%2Fyt%2FzpKIqBkYlkRENrRMN5yI1NMC8dI0LROWLfAymk7V9SKyQ7X9n91wIiIbGJZERDYwLImIbOi4sNzv74OpdVjV79ltmDdjzRwH6zDRPnRUWFarVUxNTWF7e1ueRW0oHA5j51do%2BsPr9eL48eOmUYvK5TJOnDiBiYkJaIY6TPJQcESNdFRYxuNxrK2tyZNJIfF4HH19fZiZmdGn1avDJA8FR9RIx4RlPp9HPB7HhQsX4HQ65dmkCDHMm7GQWaFQQDAYNJWUECMP1RvOjUjWEWEput9i0F9Sm7EmT7VaRbFYrDsc30GWoiC1dERYrq6uYnNzs2ZkbVKTx%2BNBV1eXPJnokSgflqKw1eLi4iNV9iOizqZ8WM7MzCAYDGJ0dFSeRYoqlUrY2tqSJxM9EqXDslwuI5PJIJFI6PfX%2Bf1%2BbG9vY2xsjPfaKcpYP9zlcsHr9dY9N1nvXCaRTOmw7O7uRrFYNN2Hl8vl4HQ6kUqlHksZVXq8qtUq5ufnTVe%2F%2B%2Fv7kclkTLcJiavgj1KPhzqL0mFJnWdycrLmYp64v1LceynOY09MTPA8NtnGsKS2ZTy9Ih7FYhHr6%2BumEOzu7saNGzeQyWTgcDjg8XgQDAYxPT1tWh5RIxzP8gCpul5Edqi2%2F%2FPIkojIBoYlEZENLdMNJyL1tEC8NE3LhGULvIymU3W9iOxQbf9nN5yIyAaGJRGRDR0RlrFYrOZ%2BPK%2FXy4Ff29R%2BykoI4rksK0J71RFhWSgUakoQFItF%2FnqjzcnbVKtTVsJocnKSo%2BXTvigflrsN%2FkpqsSorAUPBMlFigmivlA%2FLSqWCb775BkNDQ%2FIsUpBVWQlRsKyvrw%2Brq6ssK0L7onxY5nI53Lx5E36%2Fn%2BcrO4SxrAQMo09lMhm43W6pNZE9yoelGMcwlUrp57WCwSBOnDjBwFQUy0rQQVA%2BLKenp6FpmmmkdDF8F89fEZFdyoelFbfbjb6%2BvrqjZ1N7Y1kJOggdGZakNmNZCaJmUT4sI5FIzY3KlUoFm5ubCIVCprbU%2FqzKShA1g%2FJhef78eWSzWcTjcWDnw3TmzBn09fVhcHBQbk5tzqqsBFEzKB%2BWPp8P169fx9zcHBwOh37ryEcffQSXyyU3pzZit6wEUTNwiLYDpOp6Edmh2v6v%2FJElEVEzMCyJiGxomW44EamnBeKlaVomLFvgZTSdquulmv8s%2Fl95Uo0fetkJ2yvV9n%2BG5QFSdb1U85f1%2F4OtSv3t9D%2BdDgz%2Fr%2F8uT6ZdqLb%2FMywPkKrrpRqGZX03b97E9va2PLkup9OJF154AVBw%2F%2B%2BIvoVchoBDtLU3eXsaH%2FKvtQS5tEgkEpGbkIXt7W0cO3bM9mMvwdpulA%2FLarWKkZERYOdnjhqHaFOG3bISsVgMc3NzyOVy0DQNpVIJmUyGgUl7onxYrq6uYnNzE5cvX9Z%2FsSN%2BCpfL5aTW1O7kshLVahVXr17F7OwsfD4fsDMY8OLiomk0daLdKB%2BWyWSyZlAFMXK2cYxLUoNcVsLlciGTyWB6etrUzuPx4Pvf%2F75pGlEjSoelsViZ8ZwVz1mqTS4rYWVlZQUOh0NvS7ubnJys%2B%2BgESoelGIpNdMnEeS2es1TbbmUlyuUylpaWanoc1JgYuUtWb7pqlA5LIRwOm7phLCvRucQQfTDsB2SfHIzy%2F1XWEWEp1wxnWQm11SsrIe6M2NzcxI0bN3hUuU8iIDspKKF6WIpQpM5iVVaCQdlcnRaUUD0sXS4XhoeHcfXqVcuyEvIRJ7U%2Fq7ISDEpqBqXDEjvnKzc3N2vKSoh5pBarshJiGoOSHkVH%2FDZcHFmsra0BAAKBwGMpK3HQ69Wp5O1pJG%2FbfD6PV155pe7P8FKpFP7Hkf%2FN34bX8Y9%2F%2FAP379%2BXJ9fldDrxwx%2F%2BEFBw%2F%2B%2BIsPyuqLpequFAGgdDtf1f%2BW44EVEzMCyJiGxomW44EamnBeKlaVomLFvgZTSdqutFZIdq%2Bz%2B74URENjAsiYhsYFgSEdmgdFg2qtXiYB2WttVou9arwZNOp03tYrGY3ISoIaXDUoySLcaxFI9oNAqn04nz58%2FLT6E2YrcGTz6fx%2Fj4OFKpFDRNQy6Xw9zcHAOT9kTpsLSSz%2BcxNzdnqslC6pBr8ADAwsICBgYGMDg4CADw%2BXyYnZ2tGWCFqJGOC0vxwemUofA7jVyDBwCWl5eRyWRMYwFwLFPaq44Ky3w%2Bj2QyiampqQMfRIO%2BO7vV4OF%2BQPvRUWG5sLBQMygsqadeDZ5yuQyv1wu%2F32%2FqlhPZ0TFhWS6XkclkMDExwTENO5QogaxpGoaHh2suBBE10jFhmcvlsLW1haGhIXkWKaZeDR4jMfAzi9aRXR0TloVCAV1dXawT3QGsavAQPaqOCkvWiVafXINH3MAu%2FwBBHH2yDhPZ1RFhWa1WUSwW%2BcHoAHINHnErUSKRQDqdBnb2h6mpKV7koT3piLAU1RxJLYlEoubnjsViEevr66YexOjoKFKpFMbGxuBwOOB2u%2BH1emvuvSRqhONZHiBV14vIDtX2%2F444siQielQMSyIiG1qmG05E6mmBeGmalgnLFngZTafqehHZodr%2Bz244EZENDEsiIhs6IizFaDPiXrx6pQeoPeynrIRROp3G4cOH9fEuiexQPiyr1SrOnDmDYDAITdNQqVQAACMjI7t%2BqKi12S0rYVQul3Hu3Dl5MtGulA%2FL1dVVZLNZvd6Oy%2BXC%2FPw8bt%2B%2BjY2NDbk5tTmrshJGMzMzuHPnjjyZaFfKhyV1FquyEkI6nUYmk8GFCxdM04nsUD4sBwcHMTAwgIWFBcAwiMKRI0dw9OhRuTkpwKqshOh%2BT0xMoKenx9CayB7lw1KUw8XOfV8cREF9VmUlEokE%2Bvr6WKiO9k35sMzn8zh8%2BDD6%2B%2Fv1iwAA4PV6614EILXk83nE43HMz8%2FzC5L2TfmwtCp9K8Y6ZEkBNRnLSojTLpOTk6wTT49E%2BbDEzlGk8YjC7Xajr6%2BPtaMVZSwrsbGxgWw2i5mZGf1ezLGxMWxvb8Pv9yMWi8lPJ7LUEWFZLBYt76nkyOnqkctK%2BHw%2B3L9%2F33QvZiqVgtPpRC6Xw%2FT0tLwIIkvKh%2BX58%2BeRzWYRj8f1aaL0gKjwR%2BqQy0oQNYvyYenz%2BXDr1i0sLS3p3bBMJoMbN26weFmbs1tWgqgZOETbAVJ1vYjsUG3%2FV%2F7IkoioGRiWREQ2tEw3nIjU0wLx0jQtE5Yt8DKaTtX1IrJDtf2f3XAiIhsYlkRENjAsiYhs6IiwlGvwRCIRuQm1kf3U4IlEIrbbEllRPizL5TJOnDih1%2BARJ5wZmO3Pbg2earWKYrGIaDRqassxTWkvlA9LMQyb8bfC0WgUmUwG6XTa0JJUYFWDp1KpYHNzkwOn0CNRPiwLhYI%2BAo3AIdrUZVWDp1Qq4Xvf%2Bx78fr%2FcnMg25cOyEYalmuQaPCsrK7h58yY8Hg%2FPV9K%2BKR%2BW%2Ff39yGQypnNYoltGapJr8BQKBX38So2142mflA%2FLoaEhbG1tmc5hsXZ0Z1leXsb9%2B%2Ff1shKidnw2m8Xq6qrcnMiS8mHp8%2Flw%2Ffp1JJNJvQv2s5%2F9DIFAQG5KijDW4KlHHH3yVAzZpXxYYicwjaUFBgcHeXVUYcYaPETNonxYxmKxmrK3uVwOW1tbGBoaMrWl9ifX4BE3sMv31ZZKJWiaxn2AbFM%2BLMU5S3G%2FZblcxrlz5xAKhVgaVUFyDR5xK1EikdDvqy2Xyzh9%2BjQGBwe5D5B9Wgs46JeRy%2BU0p9OpAdAAaNFoVG5yIA56vTpVpVLRAoGAvj2Nj0AgoFUqFfkpWiqVMrULh8NyE2oy1fZ%2Fjmd5gFRdLyI7VNv%2Fle%2BGExE1A8OSiMiGlumGE5F6WiBemqZlwrIFXkbTqbpeRHaotv%2BzG05EZAPDkojIBqXDMp%2FP48UXXzT9ekdIp9OmEgMcCLh97KeshFxapF47onqUDUvxK42vv%2F5anoV0Oo3x8XF9yK5UKoXx8XF9sFhqD3bLSsilRThEG%2B2HkmGZTqfh8Xgsh2ETvx02%2FtxxdHQUoVAICwsLcnNqM1ZlJRKJBPr6%2BhCPxwHDEG23b9%2FGxsaG4dlE9SkXlul0GmNjY4hGo6a6O4IY%2BDcUCpmmh0KhmkGCqf3IZSWq1SquXr2K4eFhU3Eyn8%2BHO3fu8LfhZJtyYTk6OgpN0zA9PS3PAgyjzYjSA0ZbW1t6KQJqX8ayEsZiZcZyuDxnSXulXFgSGctKiIGAx8bGEAqFeM6S9o1hSR0hGo1idHQUYFkJ2ieGJSnHqqyEPCo%2By0rQXnVcWIpyqFbnJru6uizPZVJ7MZaVkCs9Eu1Xx4Wl2%2B1GX18fksmkaXoymdRLEVD7kstKdHd3IxgM1mxvcfQpH3ES1dNxYWlVZiCdTiOZTOL8%2BfNyc2ozclkJADh%2F%2FjySyWRNWYmBgQEMDg4ank1UX8eFJXZuL0qlUhgbG4PD4cDY2BiuXLnCe%2B7aTCKRqPm5Y7FYxPr6uqmH4PP5cOvWLZw7dw4OhwMejwfBYBCZTMZ07yVRIxyi7QCpul5Edqi2%2F3fkkSUR0V4xLImIbGiZbjgRqacF4qVpWiYsW%2BBlNJ2q60Vkh2r7P7vhREQ2MCyJiGxQPizT6XTD4bgikQhisZg8mVrYXspKyOUk5Ae3PdmldFjm83mMj4%2FLk3WxWAyJREKeTG3CTlmJ7u5uFIvFmnbhcBi9vb0Ih8PyYoksKRuWsVgMfr8f29vb8iz9yMRYeoDUYFVWQpZOp5FIJLC4uMixAMg2JcMyFothZmYGqVSq5sihWq1iZGQEm5ubyOfz6O3tNc2n9iaXlZCJgTbC4bA%2BviWRHUqG5fT0NDRNs%2FwwuFwuZDIZFItFHlUoylhWQra6uopsNstBU2jPlAxL6mz1xrAUR5UDAwM4evSoPJuoIYYldYyNjQ1ks1lMTU1xtCHaM4YlKceqrAQArKys6COoE%2B0Vw5KUYywrYVQoFNDX1we3222aTmQHw5KUIpeVME4vFosYHh5mF5z2hWFJSrEqKwEAlUoFm5ubrLlD%2B8awpLZlt6wEGpzHJLKLQ7QdIFXXi8gO1fZ%2FHlkSEdnAsCQisqFluuFEpJ4WiJemaYmwJCJqdeyGExHZwLAkIrKBYUlEZAPDkojIBoYlEZENDEsiIhsYlkRENjAsiYhsYFgSEdnAsCQisoFhSURkA8OSiMiG%2Fwengy82j7CVogAAAABJRU5ErkJggg%3D%3D%3B%22%20value%3D%22%22%20vertex%3D%221%22%3E%3CmxGeometry%20height%3D%22285.5%22%20width%3D%22319.25%22%20x%3D%222420%22%20y%3D%223560%22%20as%3D%22geometry%22%2F%3E%3C%2FmxCell%3E%3C%2Froot%3E%3C%2FmxGraphModel%3E
- Project:
- Sub-system:
- Design by:
- Sheet title:
- Sheet
- of
- Checked by:
- Approved by:
- Revision:
- Document No:
- Size:
- Date:
- A3
- (in symbol CMP-0383-00028-1, part A) BANK 14
- (in symbol CMP-0383-00028-1, part B) BANK 15
- (in symbol CMP-0383-00028-1, part C) BANK 34
- (in symbol CMP-0383-00028-1, part D) BANK 35

## Library data of the parts
C213 C256 C257 = _CAP_C_2: CAP
D2 = LED_GREEN: LED GREEN CLEAR 0603 SMD
D11 D12 = LED_BLUE: LED BLUE CLEAR 0603 SMD
J10 = Header 4x1_2M
JP10 JP11 = JUMPER_1_1
Q7 = BJT_NPN_BEC: MF: Diotec Semiconductor; SnapEDA_Link: https://www.snapeda.com/parts/MMBT2222A/Diotec/view-part/?ref=snap; Package: SOT-23 Diotec; Value: *; MP: MMBT2222A; Check_prices: https://www.snapeda.com/parts/MMBT2222A/Diotec/view-part/?ref=eda
Q16 = BJT_PNP_BEC: MF: Diotec Semiconductor; MP: MMBT2222A; SnapEDA_Link: https://www.snapeda.com/parts/MMBT2222A/Diotec/view-part/?ref=snap; Package: SOT-23 Diotec; Value: *; Check_prices: https://www.snapeda.com/parts/MMBT2222A/Diotec/view-part/?ref=eda
R124 R185-R194 R196-R207 R218-R221 R239-R241 R243-R247 R329-R336 R351-R364 R374-R383 R390-R395 R397-R400 R454 R455 = _RES_B_2: RES
U11 = CMP-0383-00028-1: Artix-7 FPGA, 170 User I/Os, 0 GTP, 256-Ball BGA, Speed Grade 1, Commercial Grade, Pb-Free; Manufacturer: Xilinx; Speed Grades: 1; Total Block RAM: 1800 Kb; CMTs: 5; GTP: 0; Available User I/O: 170; Logic Cells: 33280; ComponentLink2Description: Datasheet; ComponentLink2URL: http://www.xilinx.com/support/documentation/data_sheets/ds180_7Series_Overview.pdf; ComponentLink1Description: Manufacturer URL; Operating Temperature Range: Commercial; PackageVersion: Rev. 1.11; ComponentLink4URL: http://www.xilinx.com/support/documentation/user_guides/ug475_7Series_Pkg_Pinout.pdf; ComponentLink4Description: Package Specification; PackageDescription: 256-Ball Wire-Bond Fine-Pitch Thin BGA, Body 17 x 17 mm, Pitch 1 mm; Mounting Technology: Surface Mount; ComponentLink1URL: http://www.xilinx.com/; Maximum Distributed RAM: 400 Kb; PackageReference: FTG-256; DatasheetVersion: Rev. 1.15; ComponentLink3Description: Pinout; PartNumber: XC7A35T-1FTG256C; ComponentLink3URL: http://www.xilinx.com/support/documentation/user_guides/ug475_7Series_Pkg_Pinout.pdf
X1 = SIT8008AI-11-XXE-100.000000: Oscillator MEMS 100MHz ±20ppm (Stability) 15pF HCMOS/LVCMOS 55% 2.5V/2.8V/3V/3.3V Medical 4-Pin QFN SMD T/R; Manufacturer: SiTime; Manufacturer Part Number: SIT8008AI-11-XXE-100.000000E; Max Supply Current: 4.5mA; Supplier 1: Avnet; RoHS: Yes; Category: Oscillators; Pricing 1: 1000=0.93600, 2000=0.91104, 4000=0.88608, 6000=0.86112, 8000=0.83616 (USD); Mount: Surface Mount; Case/Package: SMD/SMT; Min Operating Temperature: -40°C; Max Operating Temperature: 85°C; Packaging: Tape and Reel; Frequency: 100MHz; Frequency Stability: 20ppm; RoHS Compliant: Yes; ComponentLink1URL: https://media.digikey.com/pdf/Data%20Sheets/SiTime%20PDFs/New_Rev_FAQ.pdf?src-supplier=Digi-Key; ComponentLink1Description: https://media.digikey.com/pdf/Data%20Sheets/SiTime%20PDFs/New_Rev_FAQ.pdf?src-supplier=Digi-Key; Supplier Part Number 1: SIT8008AI-11-XXE-100.000000E